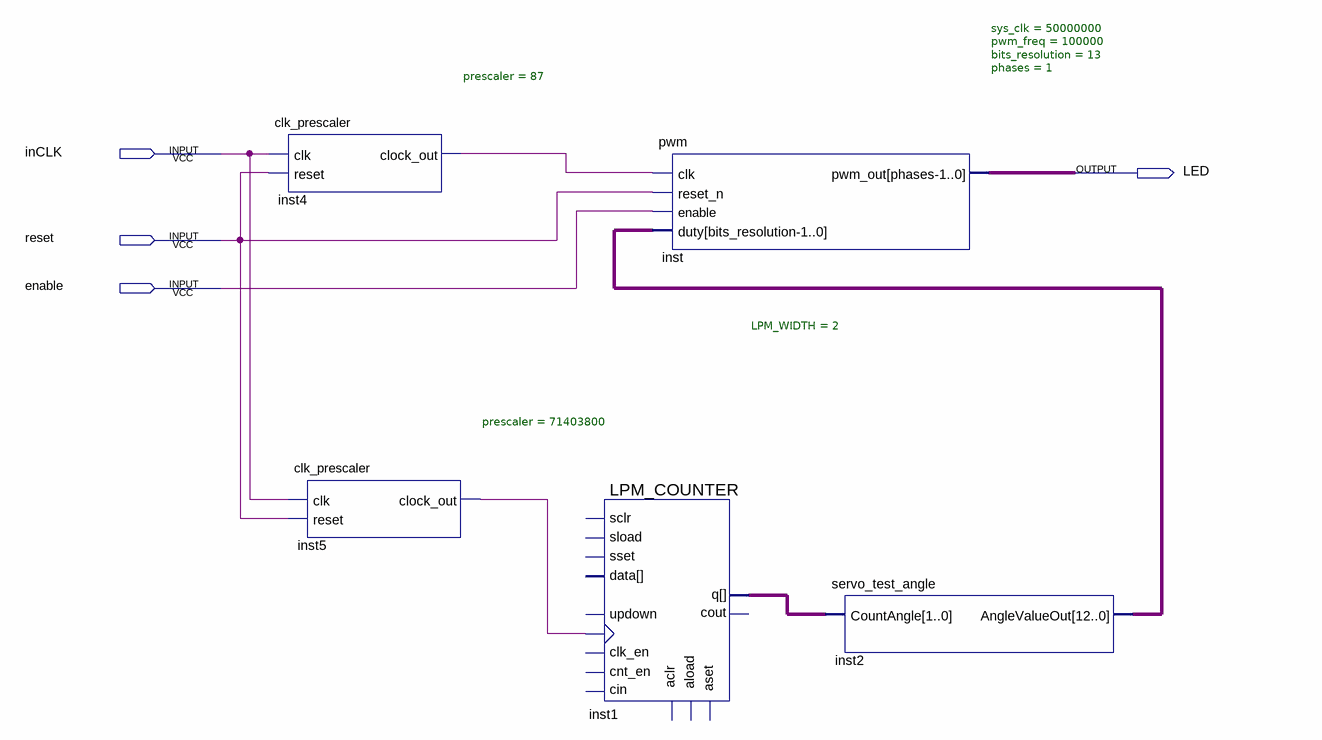
[diagram p0: schematic sheet]
// Quartus schematic pwm_prescale_block.bdf as structural Verilog: 5 symbols, 4 pins
module pwm_prescale_block (
  input  inCLK,
  input  reset,
  input  enable,
  output LED
);

  wire inst4_clock_out, inst5_clock_out;
  wire [1:0] inst1_q;
  wire [12:0] inst2_anglevalueout;

  clk_prescaler #(.prescaler(87)) inst4 (.clk(inCLK), .reset(reset), .clock_out(inst4_clock_out));
  clk_prescaler #(.prescaler(71403800)) inst5 (.clk(inCLK), .reset(reset), .clock_out(inst5_clock_out));
  LPM_COUNTER #(.LPM_WIDTH(2)) inst1 (
    .clock(inst5_clock_out), .q(inst1_q));  // open: sload, data, clk_en, aload, aclr, aset, cin, sset, updown, cnt_en, sclr, cout
  pwm #(.sys_clk(50000000), .pwm_freq(100000), .bits_resolution(13), .phases(1)) inst (
    .clk(inst4_clock_out), .reset_n(reset), .enable(enable), .duty(inst2_anglevalueout), .pwm_out(LED));
  servo_test_angle inst2 (.CountAngle(inst1_q), .AngleValueOut(inst2_anglevalueout));
endmodule
